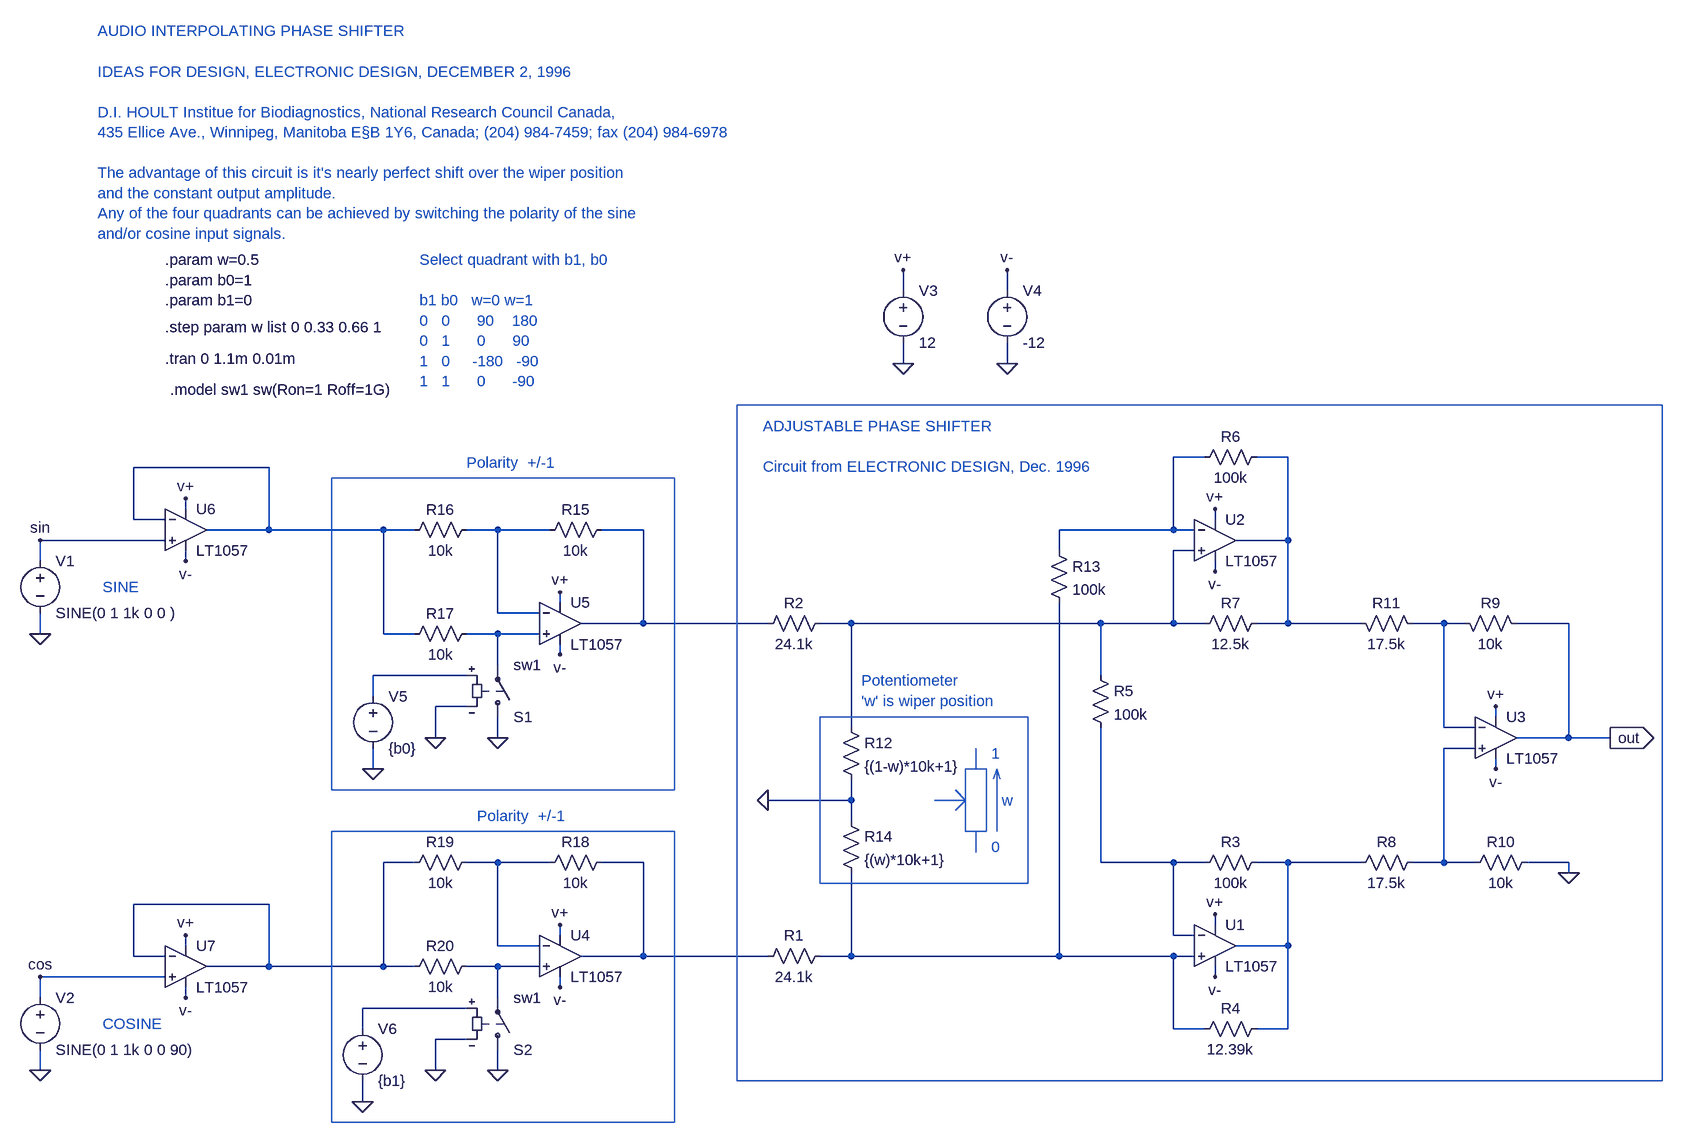
[diagram p0: schematic Audio_Interpolating_Phase_Shifter.asc]
Audio_Interpolating_Phase_Shifter.asc, the LTspice schematic file:
Version 4
SHEET 1 992 688
WIRE -400 336 -352 336
WIRE 192 192 144 192
WIRE 144 192 144 304
WIRE 144 304 176 304
WIRE 320 192 272 192
WIRE 176 336 144 336
WIRE 144 336 144 448
WIRE 144 448 192 448
WIRE 272 448 320 448
WIRE 320 448 320 320
WIRE 32 192 144 192
WIRE 144 -320 176 -320
WIRE 320 -176 320 -304
WIRE 320 -432 272 -432
WIRE 176 -288 144 -288
WIRE 144 -288 144 -176
WIRE 144 -176 192 -176
WIRE 272 -176 320 -176
WIRE 608 16 560 16
WIRE 608 -16 560 -16
WIRE 560 -16 560 -176
WIRE 672 -176 752 -176
WIRE 752 -176 752 0
WIRE 752 0 672 0
WIRE 592 -176 560 -176
WIRE 608 192 560 192
WIRE 688 192 752 192
WIRE 752 192 752 208
WIRE 144 -176 32 -176
WIRE 144 -320 -32 -320
WIRE -400 -176 -352 -176
WIRE -832 -192 -896 -192
WIRE -896 -192 -896 -320
WIRE -896 -320 -816 -320
WIRE -672 -320 -672 -176
WIRE -672 -176 -768 -176
WIRE 640 -48 640 -32
WIRE -800 -208 -800 -224
WIRE 208 288 208 272
WIRE -832 -160 -896 -160
WIRE 560 192 560 16
WIRE -32 -288 -32 -320
WIRE -32 -208 -32 336
WIRE -480 336 -672 336
WIRE -672 -176 -480 -176
WIRE 208 -352 208 -336
WIRE -800 -144 -800 -128
WIRE 208 352 208 368
WIRE 208 -272 208 -256
WIRE 640 32 640 48
WIRE 32 192 32 -16
WIRE 32 -176 32 -96
WIRE 752 0 816 0
WIRE 192 -432 144 -432
WIRE 144 -432 144 -320
WIRE 144 336 -32 336
WIRE -1600 -192 -1600 -160
WIRE -272 -608 -272 -576
WIRE -272 -688 -272 -720
WIRE -112 -608 -112 -576
WIRE -112 -688 -112 -720
WIRE -352 128 -352 96
WIRE -352 -16 -352 -176
WIRE -352 -176 32 -176
WIRE -352 208 -352 336
WIRE -352 336 -32 336
WIRE -352 96 -480 96
WIRE -352 96 -352 64
WIRE 320 -176 432 -176
WIRE 512 -176 560 -176
WIRE 512 192 560 192
WIRE 432 192 320 192
WIRE 240 -304 320 -304
WIRE 320 -304 320 -432
WIRE 240 320 320 320
WIRE 320 320 320 192
WIRE -736 -320 -672 -320
WIRE -1072 -320 -1248 -320
WIRE -1024 -160 -1072 -160
WIRE -1072 -160 -1072 -320
WIRE -1344 -320 -1248 -320
WIRE -1408 -336 -1456 -336
WIRE -1456 -336 -1456 -416
WIRE -1456 -416 -1248 -416
WIRE -1248 -416 -1248 -320
WIRE -1376 -352 -1376 -368
WIRE -1376 -288 -1376 -272
WIRE -896 -320 -944 -320
WIRE -1600 -272 -1600 -304
WIRE -1600 -304 -1408 -304
WIRE -832 320 -896 320
WIRE -896 320 -896 192
WIRE -896 192 -816 192
WIRE -672 192 -672 336
WIRE -672 336 -768 336
WIRE -800 304 -800 288
WIRE -832 352 -896 352
WIRE -800 368 -800 384
WIRE -1600 480 -1600 512
WIRE -736 192 -672 192
WIRE -1072 352 -1248 352
WIRE -1024 352 -1072 352
WIRE -1072 352 -1072 192
WIRE -1344 352 -1248 352
WIRE -1408 336 -1456 336
WIRE -1456 336 -1456 256
WIRE -1456 256 -1248 256
WIRE -1248 256 -1248 352
WIRE -1376 320 -1376 304
WIRE -1376 384 -1376 400
WIRE -896 192 -944 192
WIRE -1600 400 -1600 368
WIRE -1600 368 -1408 368
WIRE -896 480 -896 512
WIRE -896 -32 -896 0
WIRE -944 464 -992 464
WIRE -992 464 -992 512
WIRE -944 -48 -992 -48
WIRE -992 -48 -992 0
WIRE -944 -96 -1088 -96
WIRE -944 416 -1104 416
WIRE -1104 448 -1104 416
WIRE -1104 528 -1104 560
WIRE -1088 -96 -1088 -64
WIRE -1088 16 -1088 48
WIRE -1024 -320 -1072 -320
WIRE -1024 192 -1072 192
WIRE -896 -160 -896 -112
WIRE -896 -160 -944 -160
WIRE -896 352 -896 400
WIRE -896 352 -944 352
FLAG 752 208 0
FLAG 640 -48 v+
FLAG -800 -224 v+
FLAG 208 272 v+
FLAG 208 -352 v+
FLAG -800 -128 v-
FLAG 208 368 v-
FLAG 208 -256 v-
FLAG 640 48 v-
FLAG 816 0 out
IOPIN 816 0 Out
FLAG -1600 -160 0
FLAG -272 -576 0
FLAG -112 -576 0
FLAG -272 -720 v+
FLAG -112 -720 v-
FLAG -480 96 0
FLAG -1376 -368 v+
FLAG -1376 -272 v-
FLAG -800 288 v+
FLAG -800 384 v-
FLAG -1600 512 0
FLAG -1376 304 v+
FLAG -1376 400 v-
FLAG -896 0 0
FLAG -896 512 0
FLAG -992 512 0
FLAG -992 0 0
FLAG -1104 560 0
FLAG -1088 48 0
FLAG -1600 -304 sin
FLAG -1600 368 cos
SYMBOL Opamps\\LT1057 208 256 R0
SYMATTR InstName U1
SYMBOL Opamps\\LT1057 640 -64 R0
SYMATTR InstName U3
SYMBOL Opamps\\LT1057 -800 -240 R0
SYMATTR InstName U5
SYMBOL res -496 352 R270
WINDOW 0 32 56 VTop 0
WINDOW 3 0 56 VBottom 0
SYMATTR InstName R1
SYMATTR Value 24.1k
SYMBOL res -496 -160 R270
WINDOW 0 32 56 VTop 0
WINDOW 3 0 56 VBottom 0
SYMATTR InstName R2
SYMATTR Value 24.1k
SYMBOL res 176 208 R270
WINDOW 0 32 56 VTop 0
WINDOW 3 0 56 VBottom 0
SYMATTR InstName R3
SYMATTR Value 100k
SYMBOL res 176 464 R270
WINDOW 0 32 56 VTop 0
WINDOW 3 0 56 VBottom 0
SYMATTR InstName R4
SYMATTR Value 12.39k
SYMBOL res 16 -112 R0
SYMATTR InstName R5
SYMATTR Value 100k
SYMBOL Opamps\\LT1057 208 -368 R0
SYMATTR InstName U2
SYMBOL res 176 -416 R270
WINDOW 0 32 56 VTop 0
WINDOW 3 0 56 VBottom 0
SYMATTR InstName R6
SYMATTR Value 100k
SYMBOL res 176 -160 R270
WINDOW 0 32 56 VTop 0
WINDOW 3 0 56 VBottom 0
SYMATTR InstName R7
SYMATTR Value 12.5k
SYMBOL res 416 208 R270
WINDOW 0 32 56 VTop 0
WINDOW 3 0 56 VBottom 0
SYMATTR InstName R8
SYMATTR Value 17.5k
SYMBOL res 576 -192 M90
WINDOW 0 0 56 VBottom 0
WINDOW 3 32 56 VTop 0
SYMATTR InstName R9
SYMATTR Value 10k
SYMBOL res 592 208 R270
WINDOW 0 32 56 VTop 0
WINDOW 3 0 56 VBottom 0
SYMATTR InstName R10
SYMATTR Value 10k
SYMBOL res 528 -160 M270
WINDOW 0 32 56 VTop 0
WINDOW 3 0 56 VBottom 0
SYMATTR InstName R11
SYMATTR Value 17.5k
SYMBOL res -48 -304 R0
SYMATTR InstName R13
SYMATTR Value 100k
SYMBOL res -368 -32 R0
SYMATTR InstName R12
SYMATTR Value {(1-w)*10k+1}
SYMBOL voltage -1600 -288 R0
WINDOW 123 0 0 Left 0
WINDOW 39 0 0 Left 0
SYMATTR InstName V1
SYMATTR Value SINE(0 1 1k 0 0 )
SYMBOL voltage -272 -704 R0
WINDOW 123 0 0 Left 0
WINDOW 39 0 0 Left 0
SYMATTR InstName V3
SYMATTR Value 12
SYMBOL voltage -112 -704 R0
WINDOW 123 0 0 Left 0
WINDOW 39 0 0 Left 0
SYMATTR InstName V4
SYMATTR Value -12
SYMBOL res -368 112 R0
SYMATTR InstName R14
SYMATTR Value {(w)*10k+1}
SYMBOL res -832 -304 R270
WINDOW 0 32 56 VTop 0
WINDOW 3 0 56 VBottom 0
SYMATTR InstName R15
SYMATTR Value 10k
SYMBOL res -1040 -304 R270
WINDOW 0 32 56 VTop 0
WINDOW 3 0 56 VBottom 0
SYMATTR InstName R16
SYMATTR Value 10k
SYMBOL res -1040 -144 R270
WINDOW 0 32 56 VTop 0
WINDOW 3 0 56 VBottom 0
SYMATTR InstName R17
SYMATTR Value 10k
SYMBOL Opamps\\LT1057 -1376 -384 R0
SYMATTR InstName U6
SYMBOL Opamps\\LT1057 -800 272 R0
SYMATTR InstName U4
SYMBOL voltage -1600 384 R0
WINDOW 123 0 0 Left 0
WINDOW 39 0 0 Left 0
SYMATTR InstName V2
SYMATTR Value SINE(0 1 1k 0 0 90)
SYMBOL res -832 208 R270
WINDOW 0 32 56 VTop 0
WINDOW 3 0 56 VBottom 0
SYMATTR InstName R18
SYMATTR Value 10k
SYMBOL res -1040 208 R270
WINDOW 0 32 56 VTop 0
WINDOW 3 0 56 VBottom 0
SYMATTR InstName R19
SYMATTR Value 10k
SYMBOL res -1040 368 R270
WINDOW 0 32 56 VTop 0
WINDOW 3 0 56 VBottom 0
SYMATTR InstName R20
SYMATTR Value 10k
SYMBOL Opamps\\LT1057 -1376 288 R0
SYMATTR InstName U7
SYMBOL sw -896 -16 M180
SYMATTR InstName S1
SYMATTR Value sw1
SYMBOL sw -896 496 M180
SYMATTR InstName S2
SYMATTR Value sw1
SYMBOL voltage -1088 -80 R0
SYMATTR InstName V5
SYMATTR Value {b0}
SYMBOL voltage -1104 432 R0
SYMATTR InstName V6
SYMATTR Value {b1}
TEXT -1408 -584 Left 0 !.tran 0 1.1m 0.01m
TEXT -1408 -736 Left 0 !.param w=0.5\n.param b0=1\n.param b1=0
TEXT -1408 -632 Left 0 !.step param w list 0 0.33 0.66 1
TEXT -336 -88 Left 0 ;Potentiometer\n'w' is wiper position
TEXT -1504 -232 Left 0 ;SINE
TEXT -1504 440 Left 0 ;COSINE
TEXT -1400 -536 Left 0 !.model sw1 sw(Ron=1 Roff=1G)
TEXT -1016 -736 Left 0 ;Select quadrant with b1, b0\n \nb1 b0   w=0 w=1\n0   0      90    180\n0   1      0      90\n1   0     -180   -90\n1   1      0      -90
TEXT -944 -424 Left 0 ;Polarity  +/-1
TEXT -928 120 Left 0 ;Polarity  +/-1
TEXT -488 -480 Left 0 ;ADJUSTABLE PHASE SHIFTER\n \nCircuit from ELECTRONIC DESIGN, Dec. 1996
TEXT -136 168 Left 0 ;0
TEXT -136 24 Left 0 ;1
TEXT -120 96 Left 0 ;w
TEXT -1512 -1088 Left 0 ;AUDIO INTERPOLATING PHASE SHIFTER\n \nIDEAS FOR DESIGN, ELECTRONIC DESIGN, DECEMBER 2, 1996\n \nD.I. HOULT Institue for Biodiagnostics, National Research Council Canada, \n435 Ellice Ave., Winnipeg, Manitoba E§B 1Y6, Canada; (204) 984-7459; fax (204) 984-6978\n \nThe advantage of this circuit is it's nearly perfect shift over the wiper position \nand the constant output amplitude.\nAny of the four quadrants can be achieved by switching the polarity of the sine\nand/or cosine input signals.
LINE Normal -192 96 -208 96
LINE Normal -176 96 -192 96
LINE Normal -192 80 -176 96
LINE Normal -176 96 -192 80
LINE Normal -192 80 -176 96
LINE Normal -192 80 -192 80
LINE Normal -192 112 -176 96
LINE Normal -224 96 -208 96
LINE Normal -160 16 -160 48
LINE Normal -160 176 -160 144
LINE Normal -128 48 -128 144
LINE Normal -133 63 -128 48
LINE Normal -123 63 -128 48
RECTANGLE Normal -80 224 -400 -32
RECTANGLE Normal -624 592 -1152 144
RECTANGLE Normal -624 80 -1152 -400
RECTANGLE Normal 896 528 -528 -512
RECTANGLE Normal -144 144 -176 48

The netlist it stands for:
* Audio_Interpolating_Phase_Shifter.asc
XU1 N001 N002 v+ v- N003 LT1057  ; pins In+ In- V+ V- OUT
XU3 N007 N008 v+ v- out LT1057  ; pins In+ In- V+ V- OUT
XU5 N011 N009 v+ v- N010 LT1057  ; pins In+ In- V+ V- OUT
R1 N012 N001 24.1k
R2 N010 N006 24.1k
R3 N002 N003 100k
R4 N001 N003 12.39k
R5 N006 N002 100k
XU2 N006 N004 v+ v- N005 LT1057  ; pins In+ In- V+ V- OUT
R6 N004 N005 100k
R7 N006 N005 12.5k
R8 N003 N007 17.5k
R9 N008 out 10k
R10 N007 0 10k
R11 N008 N005 17.5k
R13 N004 N001 100k
R12 N006 0 {(1-w)*10k+1}
V1 sin 0 SINE(0 1 1k 0 0 )
V3 v+ 0 12
V4 v- 0 -12
R14 0 N001 {(w)*10k+1}
R15 N009 N010 10k
R16 N013 N009 10k
R17 N013 N011 10k
XU6 sin N013 v+ v- N013 LT1057  ; pins In+ In- V+ V- OUT
XU4 N015 N014 v+ v- N012 LT1057  ; pins In+ In- V+ V- OUT
V2 cos 0 SINE(0 1 1k 0 0 90)
R18 N014 N012 10k
R19 N016 N014 10k
R20 N016 N015 10k
XU7 cos N016 v+ v- N016 LT1057  ; pins In+ In- V+ V- OUT
S1 0 N011 N017 0 sw1
S2 0 N015 N018 0 sw1
V5 N017 0 {b0}
V6 N018 0 {b1}
.tran 0 1.1m 0.01m
.param w=0.5
.param b0=1
.param b1=0
.step param w list 0 0.33 0.66 1
* Potentiometer
* 'w' is wiper position
* SINE
* COSINE
.model sw1 sw(Ron=1 Roff=1G)
* Select quadrant with b1, b0
* b1 b0   w=0 w=1
* 0   0      90    180
* 0   1      0      90
* 1   0     -180   -90
* 1   1      0      -90
* Polarity  +/-1
* Polarity  +/-1
* ADJUSTABLE PHASE SHIFTER
* Circuit from ELECTRONIC DESIGN, Dec. 1996
* 0
* 1
* w
* AUDIO INTERPOLATING PHASE SHIFTER
* IDEAS FOR DESIGN, ELECTRONIC DESIGN, DECEMBER 2, 1996
* D.I. HOULT Institue for Biodiagnostics, National Research Council Canada,
* 435 Ellice Ave., Winnipeg, Manitoba E§B 1Y6, Canada; (204) 984-7459; fax (204) 984-6978
* The advantage of this circuit is it's nearly perfect shift over the wiper position
* and the constant output amplitude.
* Any of the four quadrants can be achieved by switching the polarity of the sine
* and/or cosine input signals.
.lib LTC.lib
.backanno
.end